# EasyEDA Pro project XIAO ESP32C3 Adapter board copy.eprj

# Schematic XIAO ESP32C3 Adapter board copy
Board Name: XIAO ESP32C3 Adapter board copy; Create Date: 2026-01-24; Page Name: Sheet_1 copy; Project Name: XIAO ESP32C3 Adapter board copy; Schematic Name: XIAO ESP32C3 Adapter board copy; Update Date: 2026-01-28; Add into BOM: yes; Company: Your Company; Convert to PCB: yes; Date: 2023-02-12; Draw By: ozlow.own; REV: 1.0; Sheet: 1/1; spicePre: .
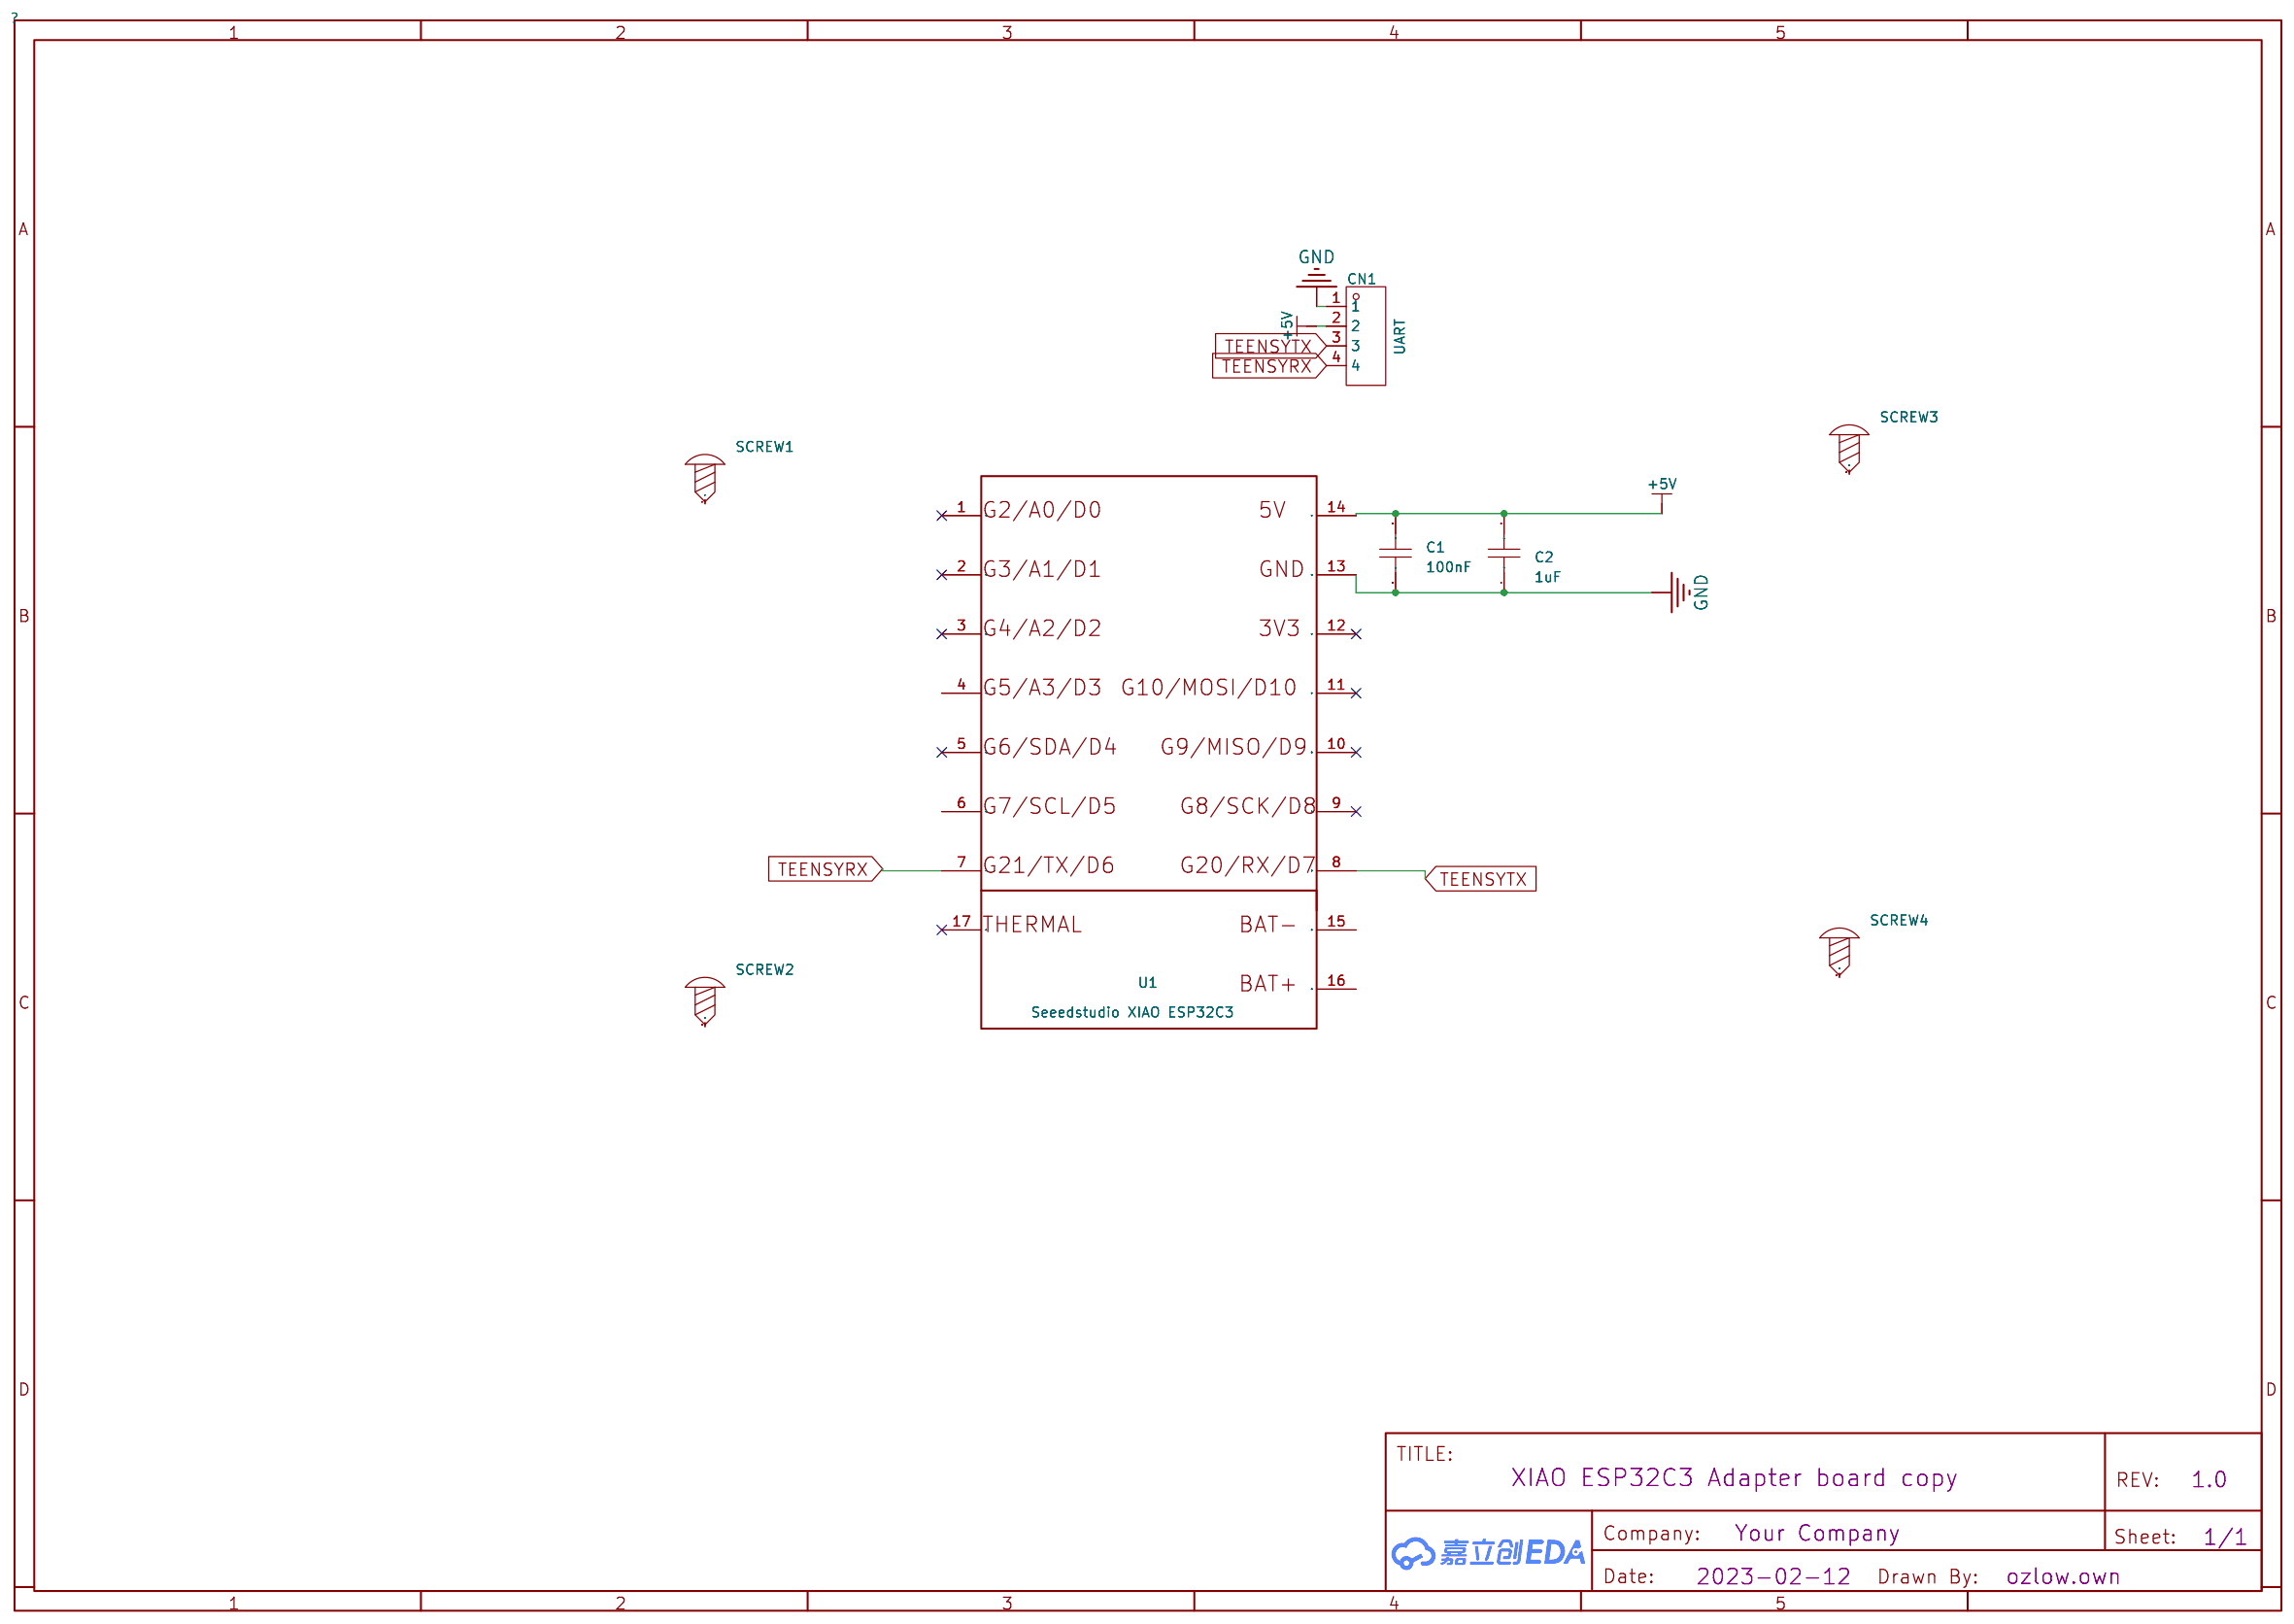
[diagram p0: schematic sheet]

## Parts
C1  100nF  [C0603]
C2  1uF  [C0603]
CN1  UART  [CONN-TH_4P-P2.50_4PIN]
SCREW1  -  [Screw-Hole-M2]
SCREW2  -  [Screw-Hole-M2]
SCREW3  -  [Screw-Hole-M2]
SCREW4  -  [Screw-Hole-M2]
U1  Seeedstudio XIAO ESP32C3  [SEEED_XIAO_ESP32C3_CASTELLATED]

## Library data of the parts
C1 = C0201B104K016T: Capacitance:100nF Tolerance:±10% Tolerance:±10% Voltage Rating:16V Temperature Coefficient:-; LCSC Part Name: 100nF ±10% 16V; Supplier Part: C961494; Manufacturer: IHHEC(禾伸堂); Supplier Footprint: 0201; JLCPCB Part Class: Extended Part; Datasheet: https://item.szlcsc.com/datasheet/C0201B104K016T/1041333.html; Supplier: LCSC; Tolerance: ±10%; Voltage Rating: 16V
C2 = CC0201KRX5R5BB105: Capacitance:1uF Tolerance:±10% Tolerance:±10% Voltage Rating:6.3V Temperature Coefficient:X5R; LCSC Part Name: 1uF ±10% 6.3V; Supplier Part: C541330; Manufacturer: YAGEO(国巨); Supplier Footprint: 0201; JLCPCB Part Class: Extended Part; Datasheet: https://item.szlcsc.com/datasheet/CC0201KRX5R5BB105/561826.html; Supplier: LCSC; Tolerance: ±10%; Voltage Rating: 6.3V; Temperature Coefficient: X5R
CN1 = ZX-XH2.54-4PZZ: LCSC Part Name: 1x4P 间距:2.5mm 直插 系列:XH; Supplier Part: C7429634; Manufacturer: Megastar(兆星); Manufacturer Part: XH2.54-4; Supplier Footprint: 插件,P=2.5mm; JLCPCB Part Class: Extended Part; Datasheet: https://item.szlcsc.com/datasheet/ZX-XH2.54-4PZZ/8427551.html; Supplier: LCSC; Pins Structure: 1x4P; Pitch: 2.5mm; Mounting Type: Through Hole; Reference Series: XH; Number of Pins: 4P; Number of Rows: 1; Number of PINs Per Row: 4; Current Rating: 3A; Contact Material: Brass; Contact Plating: Tin; Operating Temperature: -25℃~+85℃; Voltage Rating: 250V; Plastic Material: PA66; Flame Retardant Rating: UL94V-0; Color: White; Z-Height of the Board: 7mm; X-Length of Bottom Edge on Board (Spacing Line): 12.5mm; Y-Width of Bottom Edge on Board: 5.9mm
SCREW1-SCREW4 = Screw-Hole-M2: Supplier Footprint: 插件
U1 = 113991054: Manufacturer: Seeedstudio; link: https://www.seeedstudio.com/Seeed-XIAO-ESP32C3-p-5431.html; Contributor: ozlow.own; spicePre: U

## Nets
+5V: C1.2 C2.2 CN1.2 U1.14
GND: C1.1 C2.1 CN1.1 U1.13
TEENSYRX: CN1.4 U1.7
TEENSYTX: CN1.3 U1.8

Not connected (* = marked no-connect by the designer): SCREW1 1; SCREW2 1; SCREW3 1; SCREW4 1; U1 1* 2* 3* 4 5* 6 9* 10* 11* 12* 15 16 17*

# Board 1-PCB_PCB_XIAO ESP32C3 Adapter board copy
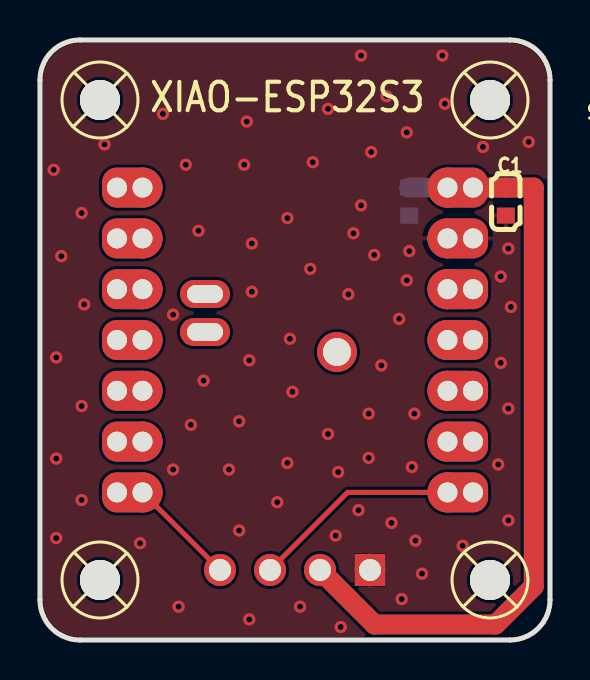
[diagram p1: board, top side]
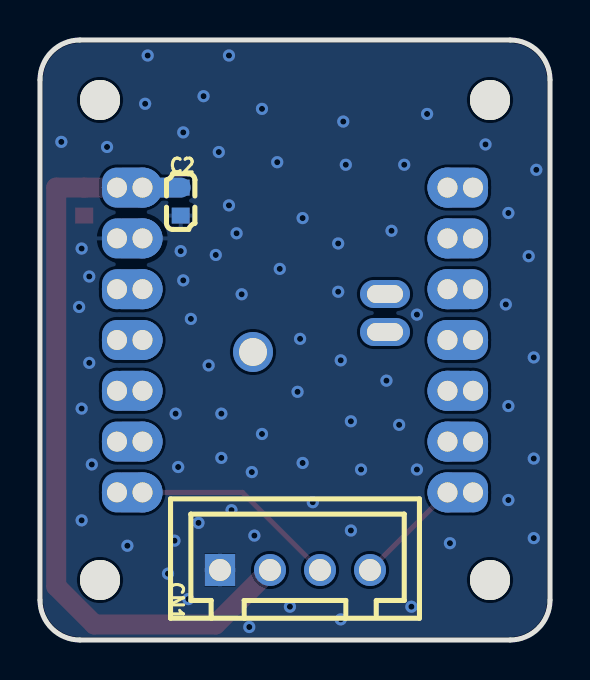
[diagram p2: board, bottom side, seen from below]

Outline 25.5 x 30 mm; copper layers: Top Layer, Bottom Layer. Coordinates in mm from the lower left corner of the outline.
Outline path: 0,28 0,2 arc(0.59,0.59) 2,0 23.5,0 arc(24.91,0.59) 25.5,2 25.5,28 arc(24.91,29.41) 23.5,30 2,30 arc(0.59,29.41) 0,28
Stack: Top Layer 0.035mm / Dielectric1 1.51mm FR4 er 4.5 / Bottom Layer 0.035mm

## Design rules (mm)
spacing Default (default): track to track 0.152, other pairs 0 to 0.152
track width Default (default): min 0.254, default 0.254, max 25.4
differential pair differentialPair (default): width min 0.127, default 0.254, max 2.54; gap min 0.152, default 0.152
via Default (default): diameter min 0.61, default 0.61, max 100.025; hole min 0.305, default 0.305, max 59.995

## Placement (name value [footprint] x y rotation side)
C1  100nF  [C0603]  23.29 21.92 90 top
C2  1uF  [C0603]  18.47 21.92 90 bottom
CN1  UART  [CONN-TH_4P-P2.50_4PIN]  12.75 3.5 180 bottom
SCREW1  -  [Screw-Hole-M2]  3 27 0 top
SCREW2  -  [Screw-Hole-M2]  3 3 0 top
SCREW3  -  [Screw-Hole-M2]  22.5 27 0 top
SCREW4  -  [Screw-Hole-M2]  22.5 3 0 top
U1  Seeedstudio XIAO ESP32C3  [SEEED_XIAO_ESP32C3_CASTELLATED]  12.75 15 0 top

## Footprints (pads in the part's own frame, mm; a bottom-side part is the same pattern mirrored in y, then rotated)
C0603
  rect 0.8x0.9 smd: 1(-0.7,0) 2(0.7,0)
CONN-TH_4P-P2.50_4PIN
  rect 1.524x1.6 hole 1.1: 1(-3.75,0)
  round 1.6 hole 1.1: 2(-1.25,0) 3(1.25,0) 4(3.75,0)
Screw-Hole-M2
  round 2 hole 2: 1(0,0)
SEEED_XIAO_ESP32C3_CASTELLATED
  oval 1.5x2 hole 1: 1(-8.899,7.62) 2(-8.899,5.08) 3(-8.899,2.539) 4(-8.899,-0.001) 5(-8.899,-2.541) 6(-8.899,-5.08) 7(-8.899,-7.62) 8(8.9,-7.62) 9(8.9,-5.08) 10(8.9,-2.54) 11(8.9,0) 12(8.9,2.54) 13(8.9,5.08) 14(8.9,7.62)
  oval 3.03x2 smd: 1(-8.14,7.62) 2(-8.14,5.08) 3(-8.14,2.54) 4(-8.14,0) 5(-8.14,-2.54) 6(-8.14,-5.08) 7(-8.14,-7.62) 8(8.14,-7.62) 9(8.14,-5.08) 10(8.14,-2.539) 11(8.14,0.001) 12(8.14,2.54) 13(8.14,5.08) 14(8.14,7.62)
  oval 3.03x2 smd far side: 1(-8.14,7.62) 2(-8.14,5.08) 3(-8.14,2.54) 4(-8.14,0) 5(-8.14,-2.54) 6(-8.14,-5.08) 7(-8.14,-7.62) 8(8.14,-7.62) 9(8.14,-5.08) 10(8.14,-2.541) 11(8.14,-0.001) 12(8.14,2.539) 13(8.14,5.08) 14(8.14,7.62)
  round 2 hole 1: 1(-7.625,7.62) 2(-7.625,5.08) 3(-7.625,2.54) 4(-7.625,0) 5(-7.625,-2.54) 6(-7.625,-5.08) 7(-7.625,-7.62) 8(7.625,-7.62) 9(7.625,-5.08) 10(7.625,-2.54) 11(7.625,0) 12(7.625,2.54) 13(7.625,5.08) 14(7.625,7.62)
  oval 2.5x1.4 hole 1.8x0.9: 15(-4.5,2.3) 16(-4.5,0.4)
  round 2 hole 1.4: 17(2.1,-0.6)

## Nets
As in the schematic.

Pads without a net: SCREW1 1; SCREW2 1; SCREW3 1; SCREW4 1; U1 1 2 3 4 5 6 9 10 11 12 15 16 17

## Via types
v1: diameter 0.61, hole 0.305, Top Layer to Bottom Layer, 74 vias

## Routing (per net, layer and track width the routed paths; a pad name or vN(x,y) marks a point on that pad's centre or on a via; arc(x,y) is an arc through that point)
+5V: length 40
  Top Layer w0.254: U1.14 U1.14
  Top Layer w1: U1.14 C1.2 24.69,22.62 24.69,2.68 22.78,0.78 16.72,0.78 CN1.2
  Bottom Layer w0.762: U1.14 U1.14
  Bottom Layer w1: U1.14 C2.2
GND:
  vias: v1(0.69,23.51) v1(0.81,14.13) v1(0.81,9.07) v1(0.81,5.09) v1(1.07,19.19) v1(2.08,21.35) v1(2.08,11.7) v1(2.08,7) v1(2.21,16.78) v1(3.22,24.78) v1(5,4.84) v1(6.15,26.3) v1(6.65,16.27) v1(6.65,8.52) v1(6.93,1.67) v1(7.29,23.76) v1(7.54,10.76) v1(7.92,20.46) v1(8.18,12.97) v1(9.45,8.52) v1(9.96,10.94) v1(9.96,5.47) v1(10.21,23.76) v1(10.34,25.92) v1(10.46,13.98) v1(10.46,1.03) v1(10.59,19.83) v1(10.59,17.41) v1(11.86,6.89) v1(12.37,21.1) v1(12.37,8.85) v1(12.5,15.06) v1(12.62,12.41) v1(13,1.67) v1(13.51,18.56) v1(13.64,23.89) v1(14.4,26.56) v1(14.4,10.3) v1(14.78,5.22) v1(14.91,8.4) v1(15.04,0.65) v1(15.42,17.29) v1(15.67,20.33) v1(15.93,6.49) v1(16.05,29.22) v1(16.05,21.73) v1(16.43,11.32) v1(16.43,9.11) v1(16.56,24.4) v1(16.71,19.25) v1(17.07,13.73) v1(17.32,27.19) v1(17.58,5.86) v1(17.96,16.06) v1(18.08,2.05) v1(18.34,25.38) v1(18.34,17.98) v1(18.47,19.44) v1(18.59,8.65) v1(18.72,11.32) v1(18.77,4.97) v1(19.1,3.32) v1(20.12,29.22) v1(20.24,26.81) v1(21.13,4.71) v1(22.15,24.65) v1(22.91,8.78) v1(23.04,18.17) v1(23.04,13.86) v1(23.42,19.57) v1(23.42,11.57) v1(23.42,5.98) v1(23.54,16.65) v1(24.43,24.91)
TEENSYRX: length 5.5
  Top Layer w0.254: CN1.4 9,3.5 U1.7
TEENSYTX: length 10.5
  Top Layer w0.254: U1.8 15.38,7.38 CN1.3

## Copper pours and planes (outline as drawn; the poured copper is in the pictures)
GND on Top Layer: -4.27,33.16 27.86,33.16 27.86,-0.37 -4.27,-0.37
GND on Bottom Layer: -4.27,33.16 27.86,33.16 27.86,-0.37 -4.27,-0.37

## Text on the board
Top Silkscreen Layer: XIAO-ESP32S3
